# Altium schematic sheet 腾森_MZQ_TS01_20250701.schdoc
size A3; SheetNumber: 0; SheetTotal: 0
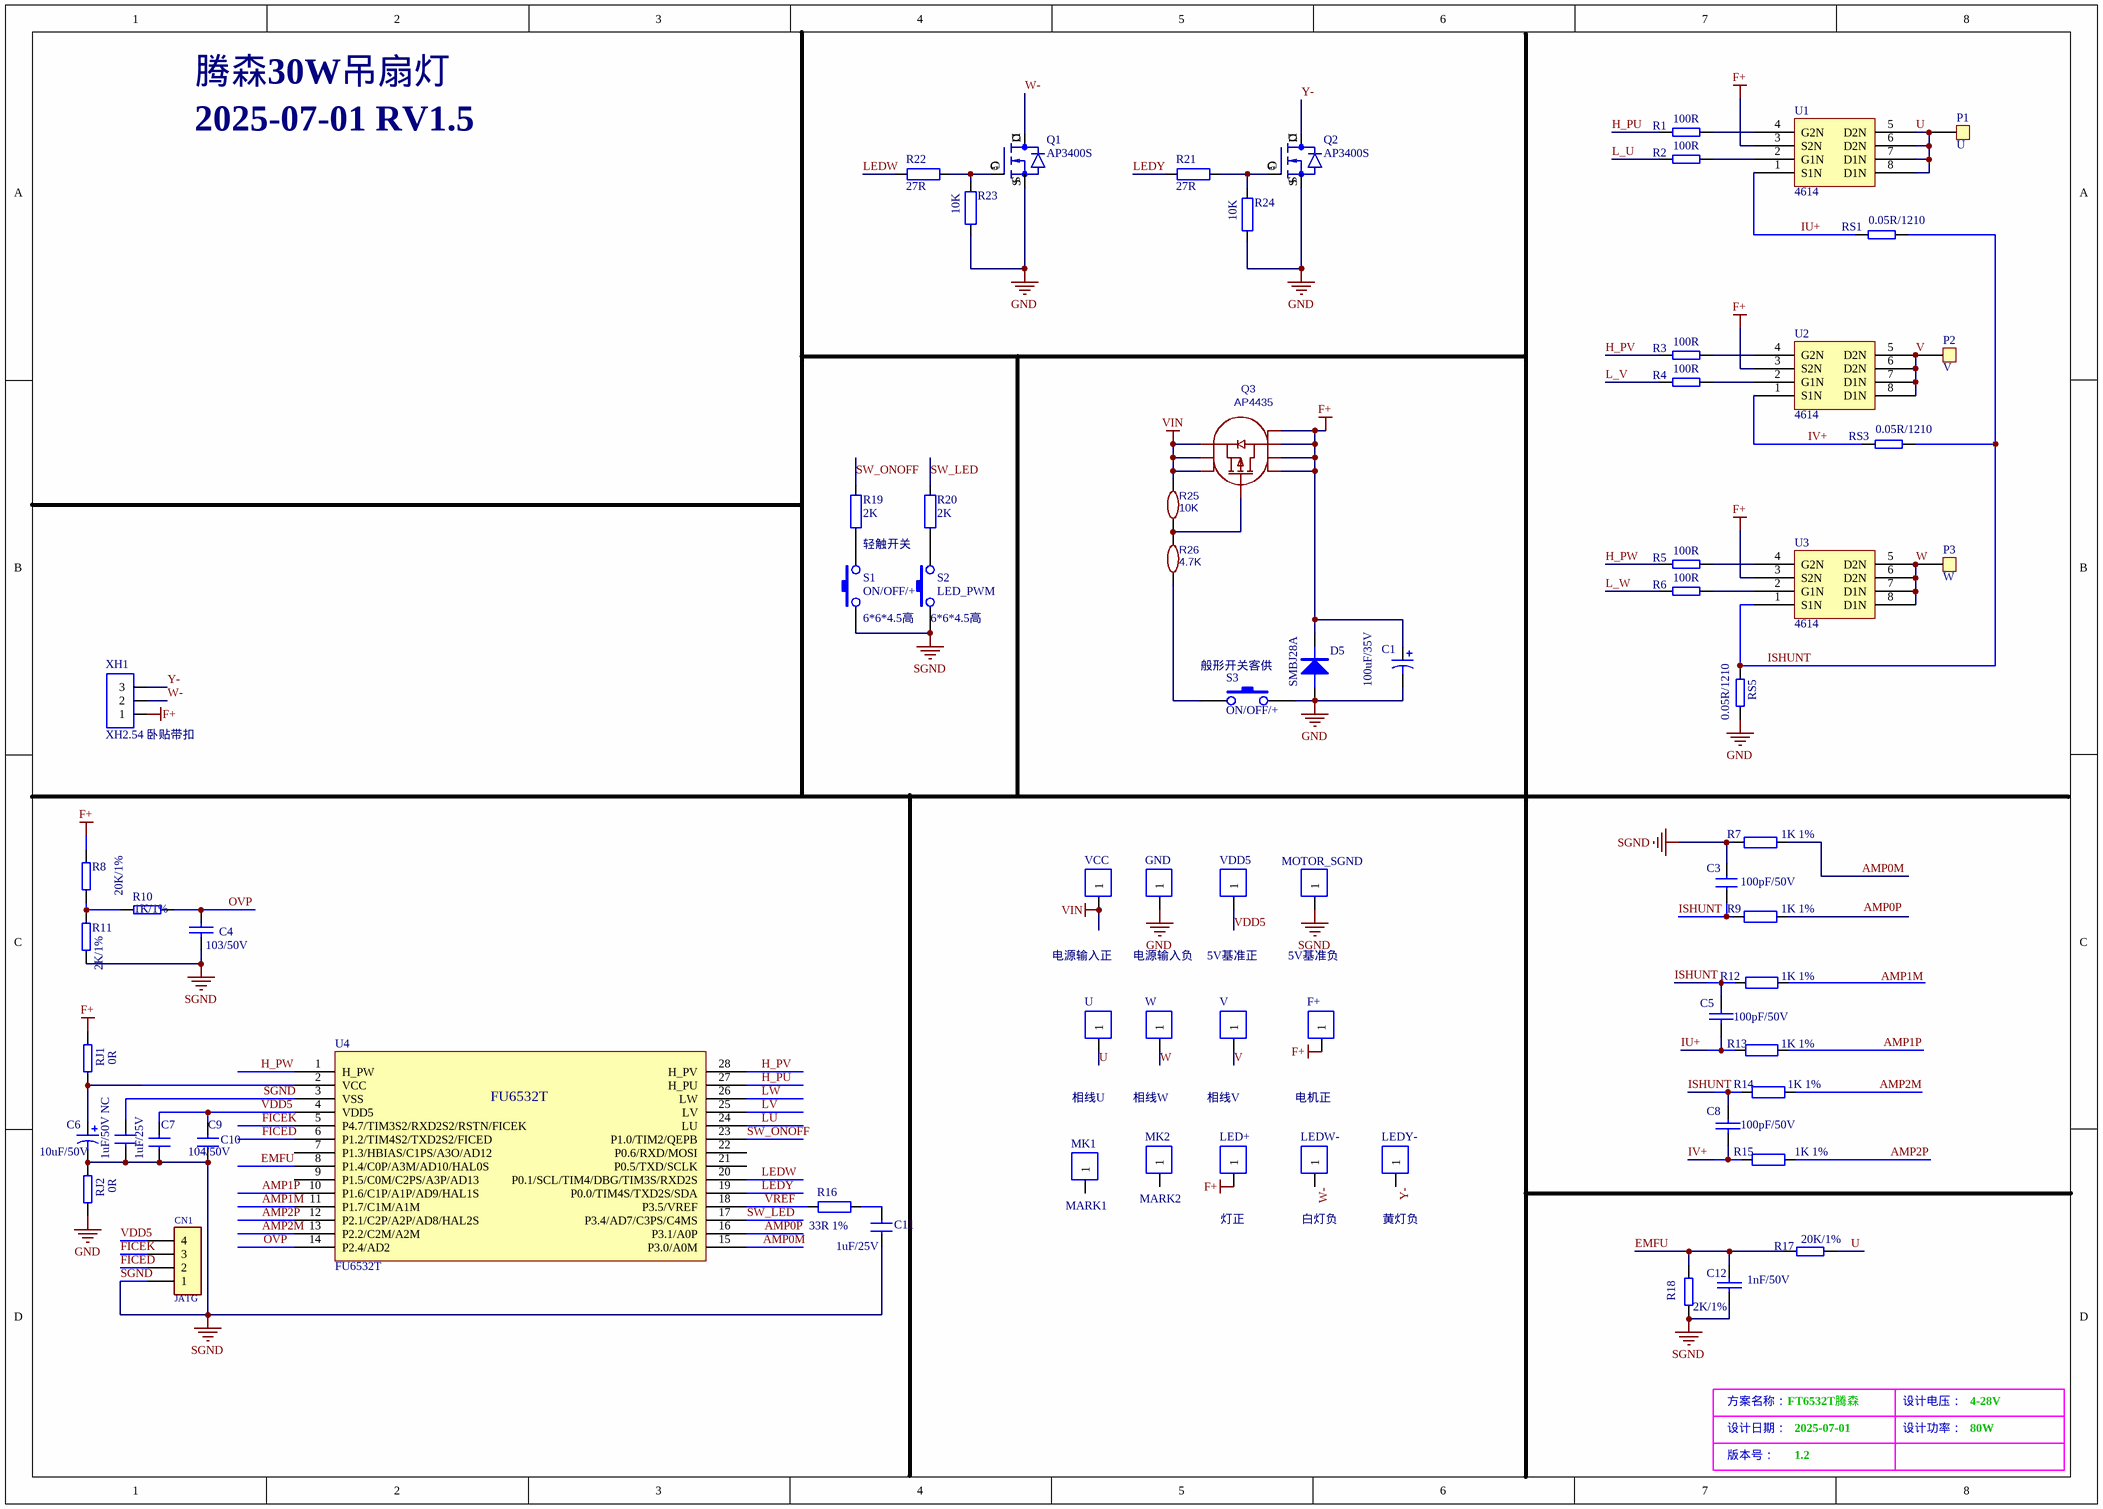
[diagram p0: 腾森_MZQ_TS01_20250701.schdoc]

## Parts
C1  100uF/35V  [CAP-6.6X6.6X5.5]
C3  100pF/50V  [0603_C]
C4  103/50V  [0603_C]
C5  100pF/50V  [0603_C]
C6  10uF/50V  [CAP-6.6X6.6X5.5]
C7  1uF/50V NC  [0603_C]
C8  100pF/50V  [0603_C]
C9  1uF/25V  [0603_C]
C10  104/50V  [0603_C]
C11  1uF/25V  [0603_C]
C12  1nF/50V  [0603_C]
CN1  JATG  [SMT-烧录口]
D5  SMBJ28A  [SMT-SMB(DO-214AA)]
F+  电机正  [test3.0_top]
GND  电源输入负  [MI-PAD]
LED+  灯正  [MI-PAD]
LEDW-  白灯负  [MI-PAD]
LEDY-  黄灯负  [MI-PAD]
MK1  MARK1  [SMT-MARK]
MK2  MARK2  [SMT-MARK]
MOTOR_SGND  5V基准负  [test3.0_top]
P1  U  [MI-PAD]
P2  V  [MI-PAD]
P3  W  [MI-PAD]
Q1  AP3400S  [SMT-SOT-23-MOS管]
Q2  AP3400S  [SMT-SOT-23-MOS管]
Q3  AP4435  [SMT-SOP8]
R1  100R  [0603]
R2  100R  [0603]
R3  100R  [0603]
R4  100R  [0603]
R5  100R  [0603]
R6  100R  [0603]
R7  1K 1%  [0603_R]
R8  20K/1%  [0603]
R9  1K 1%  [0603_R]
R10  1K/1%  [0603]
R11  2K/1%  [0603]
R12  1K 1%  [0603_R]
R13  1K 1%  [0603_R]
R14  1K 1%  [0603_R]
R15  1K 1%  [0603_R]
R16  33R 1%  [0603_R]
R17  20K/1%  [0603]
R18  2K/1%  [0603]
R19  2K  [0603_R]
R20  2K  [0603_R]
R21  27R  [0603_R]
R22  27R  [0603_R]
R23  10K  [0603_R]
R24  10K  [0603_R]
R25  10K  [0603_R]
R26  4.7K  [0603_R]
RJ1  0R  [1206]
RJ2  0R  [0603_R]
RS1  0.05R/1210  [SMT-1210R]
RS3  0.05R/1210  [SMT-1210R]
RS5  0.05R/1210  [SMT-1210R]
S1  ON/OFF/+  [SMT-6X6轻触开关通用]
S2  LED_PWM  [SMT-6X6轻触开关通用]
S3  ON/OFF/+  [SW-TH_2P-L15.0-W10.5-P5.00]
U  相线U  [test3.0_top]
U1  4614  [SO-8]
U2  4614  [SO-8]
U3  4614  [SO-8]
U4  FU6532T  [TSSOP28]
V  相线V  [test3.0_top]
VCC  电源输入正  [MI-PAD]
VDD5  5V基准正  [test3.0_top]
W  相线W  [test3.0_top]
XH1  XH2.54 卧贴带扣  [MI-VH3-2.5]

## Nets
F+: C1.1 D5.K F+.1 LED+.1 Q3.5(D) Q3.6(D) Q3.7(D) Q3.8(D) R8.2 RJ1.1 U1.3(S2N) U2.3(S2N) U3.3(S2N) XH1.1
GND: C1.2 D5.A GND.1 Q1.S Q2.S R23.2 R24.2 RJ2.2 RS5.2 S3.1
SGND: C3.1 C4.2 C6.2 C7.1 C7.2 C9.2 C10.2 C11.1 C12.2 CN1.1 MOTOR_SGND.1 R7.1 R11.1 R18.2 RJ2.1 S1.2 S2.2 U4.3(VSS)
VIN: Q3.1(S) Q3.2(S) Q3.3(S) R25.2 VCC.1
AMP0M: R7.2 U4.15(P3.0/A0M)
AMP0P: U4.16(P3.1/A0P)
AMP1M: U4.11(P1.7/C1M/A1M)
AMP1P: R13.2 U4.10(P1.6/C1P/A1P/AD9/HAL1S)
AMP2M: R14.2 U4.13(P2.2/C2M/A2M)
AMP2P: R15.2 U4.12(P2.1/C2P/A2P/AD8/HAL2S)
EMFU: C12.1 R17.1 R18.1 U4.8(P1.4/C0P/A3M/AD10/HAL0S)
FICED: CN1.2 U4.6(P1.2/TIM4S2/TXD2S2/FICED)
FICEK: CN1.3 U4.5(P4.7/TIM3S2/RXD2S2/RSTN/FICEK)
H_PU: R1.2 U4.27(H_PU)
H_PV: R3.2 U4.28(H_PV)
H_PW: R5.2 U4.1(H_PW)
ISHUNT: C3.2 C5.1 C8.1 R9.1 R12.1 R14.1 RS1.2 RS3.2 RS5.1 U3.1(S1N)
IU+: C5.2 R13.1 RS1.1 U1.1(S1N)
IV+: C8.2 R15.1 RS3.1 U2.1(S1N)
L_U: R2.2
L_V: R4.2
L_W: R6.2
LEDW: R22.1 U4.20(P0.1/SCL/TIM4/DBG/TIM3S/RXD2S)
LEDY: R21.1 U4.19(P0.0/TIM4S/TXD2S/SDA)
LU: U4.24(LU)
LV: U4.25(LV)
LW: U4.26(LW)
OVP: C4.1 R10.1 U4.14(P2.4/AD2)
SW_LED: R20.2 U4.17(P3.4/AD7/C3PS/C4MS)
SW_ONOFF: R19.2 U4.23(P1.0/TIM2/QEPB)
U: P1.1 R17.2 U.1 U1.5(D2N) U1.6(D2N) U1.7(D1N) U1.8(D1N)
V: P2.1 U2.5(D2N) U2.6(D2N) U2.7(D1N) U2.8(D1N) V.1
VDD5: C9.1 C10.1 CN1.4 U4.4(VDD5) VDD5.1
VREF: R16.1 U4.18(P3.5/VREF)
W: P3.1 U3.5(D2N) U3.6(D2N) U3.7(D1N) U3.8(D1N) W.1
W-: LEDW-.1 Q1.D XH1.2
Y-: LEDY-.1 Q2.D XH1.3
NetC6_1: C6.1 RJ1.2 U4.2(VCC)
NetC11_2: C11.2 R16.2
NetQ1_G: Q1.G R22.2 R23.1
NetQ2_G: Q2.G R21.2 R24.1
NetQ3_4: Q3.4(G) R25.1 R26.2
NetR1_1: R1.1 U1.4(G2N)
NetR2_1: R2.1 U1.2(G1N)
NetR3_1: R3.1 U2.4(G2N)
NetR4_1: R4.1 U2.2(G1N)
NetR5_1: R5.1 U3.4(G2N)
NetR6_1: R6.1 U3.2(G1N)
NetR8_1: R8.1 R10.2 R11.2
NetR19_1: R19.1 S1.1
NetR20_1: R20.1 S2.1
NetR26_1: R26.1 S3.2

Not connected (* = marked no-connect by the designer): MK1 1; MK2 1; R9 2; R12 2; U4 7(P1.3/HBIAS/C1PS/A3O/AD12) 9(P1.5/C0M/C2PS/A3P/AD13) 21(P0.5/TXD/SCLK) 22(P0.6/RXD/MOSI)

## Notes on the sheet
- 腾森30W吊扇灯
- 2025-07-01 RV1.5
- 轻触开关
- (near S1) 6*6*4.5高
- (near S2) 6*6*4.5高
- (near S3) 般形开关客供
- 方案名称：
- 设计日期：
- 版本号：
- FT6532T腾森
- 2025-07-01
- 1.2
- 设计电压：
- 设计功率：
- 4-28V
- 80W
- Labels drawn without touching a wire or pin: AMP0P, AMP1M

## Library data of the parts
C1 C6 = Cap Pol1: Polarized Capacitor (Radial); Value: 2.2uF; Published: 8-Jun-2000; LatestRevisionDate: 17-Jul-2002; LatestRevisionNote: Re-released for DXP Platform.; PackageReference: RB7.6-15; Publisher: Altium Limited; PackageDescription: Polarized Capacitor (Radial); 2 Leads
C3-C5 C7-C12 = CAP: Capacitor
CN1 = CN4: CN
D5 = DIODE: 单向TVS管
F+ GND LED+ LEDW- LEDY- MK1 MK2 MOTOR_SGND P1-P3 U V VCC VDD5 W = 1P
Q1 Q2 = N MOS
Q3 = AO4459: BOM_Manufacturer: AOS; SMT Type: Extend; BOM_Supplier: LCSC; BOM_Manufacturer Part: AO4459; image: //image.lceda.cn/szlcsc/C49047.jpg; BOM_Supplier Part: C49047; BOM_JLCPCB SMD: Yes; spicePre: Q; spiceSymbolName: AO4459
R1-R6 R8 R10 R11 R17 R18 RJ1 RJ2 RS1 RS3 RS5 = RES2
R7 R9 R12-R16 R19-R24 = Res
R25 R26 = 51K: BOM_Manufacturer: UniOhm; BOM_Manufacturer Part: 0402WGJ0165TCE; nameAlias: Resistance (Ohms); BOM_Supplier: LCSC; BOM_Supplier Part: C57065; spicePre: R; spiceSymbolName: 0402WGJ0165TCE
S1-S3 = SW-PB
U1-U3 = P2804NVG
XH1 = 3P